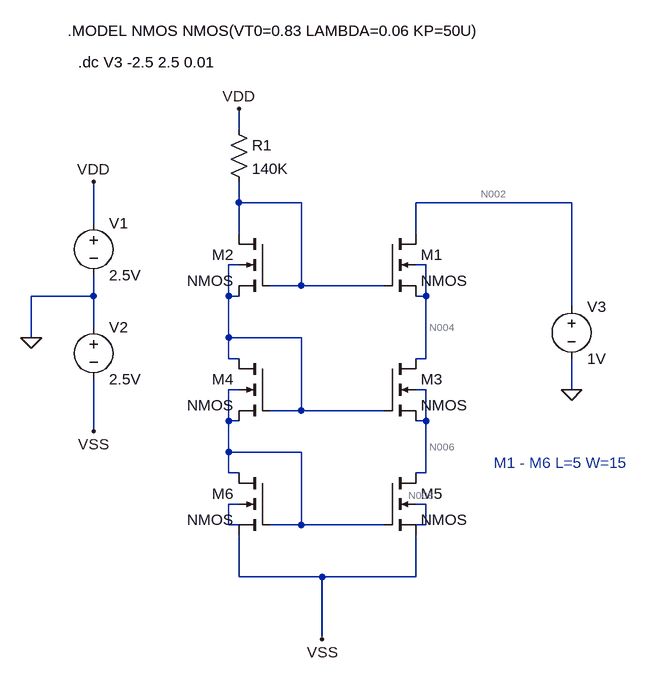
[diagram p0: schematic TCCS.asc]
TCCS.asc, the LTspice schematic file:
Version 4
SHEET 1 880 1108
WIRE -16 -48 -16 -80
WIRE -16 64 -16 32
WIRE 80 64 -16 64
WIRE 496 64 256 64
WIRE -240 96 -240 32
WIRE -16 112 -16 64
WIRE 256 112 256 64
WIRE -16 160 -32 160
WIRE 272 160 256 160
WIRE 80 192 80 64
WIRE 80 192 32 192
WIRE 208 192 80 192
WIRE -240 208 -240 176
WIRE -240 208 -336 208
WIRE -32 208 -32 160
WIRE -16 208 -32 208
WIRE 272 208 272 160
WIRE 272 208 256 208
WIRE 496 224 496 64
WIRE -240 256 -240 208
WIRE -336 272 -336 208
WIRE -32 272 -32 208
WIRE 80 272 -32 272
WIRE -32 304 -32 272
WIRE -16 304 -32 304
WIRE 272 304 272 208
WIRE 272 304 256 304
WIRE -16 352 -32 352
WIRE 272 352 256 352
WIRE 496 352 496 304
WIRE 80 384 80 272
WIRE 80 384 32 384
WIRE 208 384 80 384
WIRE -32 400 -32 352
WIRE -16 400 -32 400
WIRE 272 400 272 352
WIRE 272 400 256 400
WIRE -240 416 -240 336
WIRE -32 448 -32 400
WIRE 80 448 -32 448
WIRE -32 480 -32 448
WIRE -16 480 -32 480
WIRE 272 480 272 400
WIRE 272 480 256 480
WIRE -16 528 -32 528
WIRE 272 528 256 528
WIRE -32 560 -32 528
WIRE -16 560 -32 560
WIRE 80 560 80 448
WIRE 80 560 32 560
WIRE 208 560 80 560
WIRE 272 560 272 528
WIRE 272 560 256 560
WIRE -16 640 -16 576
WIRE 112 640 -16 640
WIRE 256 640 256 576
WIRE 256 640 112 640
WIRE 112 736 112 640
FLAG 496 352 0
FLAG -336 272 0
FLAG -240 32 VDD
FLAG -240 416 VSS
FLAG 112 736 VSS
FLAG -16 -80 VDD
SYMBOL voltage -240 80 R0
WINDOW 123 0 0 Left 2
WINDOW 39 0 0 Left 2
SYMATTR InstName V1
SYMATTR Value 2.5V
SYMBOL voltage -240 240 R0
WINDOW 123 0 0 Left 2
WINDOW 39 0 0 Left 2
SYMATTR InstName V2
SYMATTR Value 2.5V
SYMBOL voltage 496 208 R0
WINDOW 123 0 0 Left 2
WINDOW 39 0 0 Left 2
SYMATTR InstName V3
SYMATTR Value 1V
SYMBOL nmos4 208 112 R0
SYMATTR InstName M1
SYMATTR Value2 l=5 w=15
SYMBOL nmos4 32 112 M0
SYMATTR InstName M2
SYMATTR Value2 l=5 w=15
SYMBOL nmos4 208 304 R0
SYMATTR InstName M3
SYMATTR Value2 l=5 w=15
SYMBOL nmos4 32 304 M0
SYMATTR InstName M4
SYMATTR Value2 l=5 w=15
SYMBOL res -32 -64 R0
SYMATTR InstName R1
SYMATTR Value 140K
SYMBOL nmos4 208 480 R0
SYMATTR InstName M5
SYMATTR Value2 l=5 w=15
SYMBOL nmos4 32 480 M0
SYMATTR InstName M6
SYMATTR Value2 l=5 w=15
TEXT -280 -200 Left 2 !.MODEL NMOS NMOS(VT0=0.83 LAMBDA=0.06 KP=50U)
TEXT -264 -152 Left 2 !.dc V3 -2.5 2.5 0.01
TEXT 376 464 Left 2 ;M1 - M6 L=5 W=15

The netlist it stands for:
* TCCS.asc
V1 VDD 0 2.5V
V2 0 VSS 2.5V
V3 N002 0 1V
M1 N002 N001 N004 N004 NMOS l=5 w=15
M2 N001 N001 N003 N003 NMOS l=5 w=15
M3 N004 N003 N006 N006 NMOS l=5 w=15
M4 N003 N003 N005 N005 NMOS l=5 w=15
R1 VDD N001 140K
M5 N006 N005 VSS N008 NMOS l=5 w=15
M6 N005 N005 VSS N007 NMOS l=5 w=15
.model NMOS NMOS
.model PMOS PMOS
.lib standard.mos
.MODEL NMOS NMOS(VT0=0.83 LAMBDA=0.06 KP=50U)
.dc V3 -2.5 2.5 0.01
* M1 - M6 L=5 W=15
.backanno
.end

* Results of the author's LTspice run, read from the files saved beside the schematic
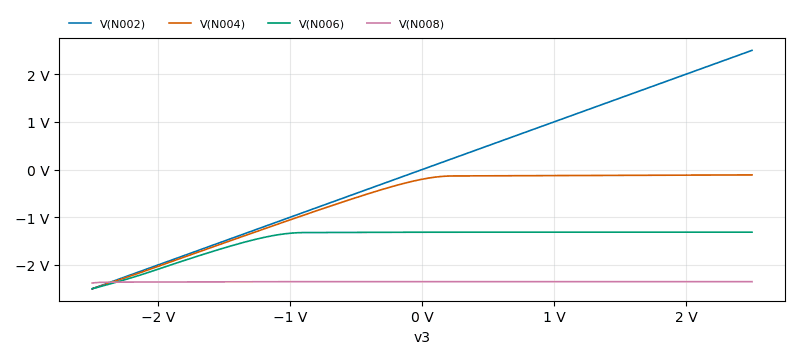
[diagram p1: DC transfer characteristic of TCCS.asc, plotted from the saved traces]
* DC transfer characteristic, 1 run:
*   V(N002): -2.5 V at v3=-2.5 V, 2.5 V at v3=2.5 V, min -2.5 V, max 2.5 V
*   V(N004): -2.5 V at v3=-2.5 V, -111.6 mV at v3=2.5 V, min -2.5 V, max -111.6 mV
*   V(N006): -2.5 V at v3=-2.5 V, -1.312 V at v3=2.5 V, min -2.5 V, max -1.312 V
*   V(N008): -2.379 V at v3=-2.5 V, -2.35 V at v3=2.5 V, min -2.379 V, max -2.35 V